# Altium schematic sheet power_supply.SchDoc
size A3
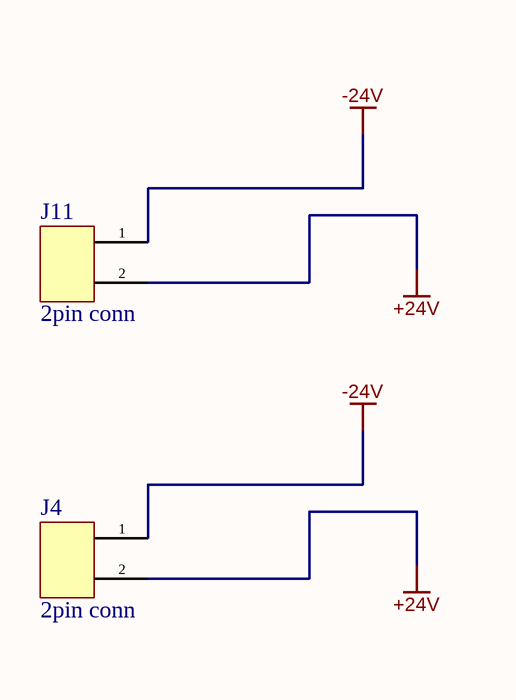
[diagram p0: power_supply.SchDoc]

## Parts
J4  2pin conn  [2pin_0.1in]
J11  2pin conn  [2pin_0.1in]

## Nets
+24V: J4.2 J11.2
-24V: J4.1 J11.1

## Library data of the parts
J4 J11 = 640456-2: CONN HEADER VERT 2POS 2.54MM; Manufacturer: TE Connectivity; Connector Type: Connector,Pin,Plug,Header; Contact Resistance: 6mR; Max Voltage Rating (AC): 250V; Number of Positions: 2; Backwall/Post Interruptions: No (Without); Connector System: Wire-to-Board; Plating Thickness: 3.81um; PCB Mount Retention: Without; Contact Current Rating: 5A; Gender: Male; PCB Mounting Orientation: Vertical; Circuit Application: Signal; Contact Style: Straight; Mating Connector Lock: Yes (With); Contact Post Length: 3.56mm; PCB Thickness: 0.063inch; Tail Length: 0.14inch; Approvals: CSA; Supplier 1: Digi-Key; Manufacturer Part Number: 640456-2; Stock 1: 105696; Pricing 1: 1=0.11, 10=0.107, 100=0.0663, 500=0.05486, 1000=0.048, 5000=0.04114, 10000=0.04 (USD); Mount: Through Hole; Color: Natural,White,Beige; Contact Plating: Tin; Contact Material: Copper Alloy; Housing Color: Natural; Housing Material: Polyester; Contact Shape: Square; Min Operating Temperature: -67°C; Max Operating Temperature: 221°C; Package Quantity: 5000; Packaging: Bulk; Termination: Solder; Number of Rows: 1; Fastening Type: Friction; Contact Gender: Male; Voltage Rating (AC): 250V; Number of Contacts: 2; Orientation: Straight; Contact Retention: No (Without); Mating Alignment: No (Without); Mating Retention: No (Without); PCB Mount Alignment: No (Without); Sealable: No (Without); Strain Relief: No (Without); Shrouded: No (Without); Current Rating: 5A; Number of Poles: 2; Voltage Rating: 250V; Working Voltage: 250V; Panel Mount Retention: No (Without); Mounting Ears: No (Without); Length: 7.62mm; Height: 7.87mm; Pitch: 2.54mm; Depth: 5.72mm; Lead Pitch: 2.54mm; Contact Mating Length: 7.49mm; Radiation Hardening: No; ELV: Compliant; Lead Free: Lead Free; Flammability Rating: UL94 V-0; REACH SVHC: No SVHC; ComponentLink1URL: https://www.te.com/commerce/DocumentDelivery/DDEController?Action=srchrtrv&DocNm=640456&DocType=Customer+Drawing&DocLang=English&src-supplier=Digi-Key; ComponentLink1Description: https://www.te.com/commerce/DocumentDelivery/DDEController?Action=srchrtrv&DocNm=640456&DocType=Customer+Drawing&DocLang=English&src-supplier=Digi-Key; ComponentLink2URL: http://www.te.com/commerce/DocumentDelivery/DDEController?Action=showdoc&DocId=Data+Sheet%7F82056_MTA%7F0608%7Fpdf%7FEnglish%7FENG_DS_82056_MTA_0608.pdf%7F640456-6&src-supplier=Avnet; ComponentLink2Description: http://www.te.com/commerce/DocumentDelivery/DDEController?Action=showdoc&DocId=Data+Sheet%7F82056_MTA%7F0608%7Fpdf%7FEnglish%7FENG_DS_82056_MTA_0608.pdf%7F640456-6&src-supplier=Avnet; ComponentLink3URL: https://www.distrelec.biz/Web/Downloads/43/01/04384301.pdf?mime=application%2Fpdf&src-supplier=Distrelec; ComponentLink3Description: https://www.distrelec.biz/Web/Downloads/43/01/04384301.pdf?mime=application%2Fpdf&src-supplier=Distrelec; ComponentLink4URL: http://www.farnell.com/datasheets/2043229.pdf?src-supplier=Newark; ComponentLink4Description: http://www.farnell.com/datasheets/2043229.pdf?src-supplier=Newark; ComponentLink5URL: http://www.te.com/commerce/DocumentDelivery/DDEController?Action=showdoc&DocId=Data+Sheet%7F82056_MTA%7F0608%7Fpdf%7FEnglish%7FENG_DS_82056_MTA_0608.pdf%7F640456-2&src-supplier=Future+Electronics; ComponentLink5Description: http://www.te.com/commerce/DocumentDelivery/DDEController?Action=showdoc&DocId=Data+Sheet%7F82056_MTA%7F0608%7Fpdf%7FEnglish%7FENG_DS_82056_MTA_0608.pdf%7F640456-2&src-supplier=Future+Electronics; ComponentLink6URL: http://www.te.com/commerce/DocumentDelivery/DDEController?Action=showdoc&DocId=Data+Sheet%7F82056_MTA%7F0608%7Fpdf%7FEnglish%7FENG_DS_82056_MTA_0608.pdf%7F640456-6&src-supplier=Avnet+Asia; ComponentLink6Description: http://www.te.com/commerce/DocumentDelivery/DDEController?Action=showdoc&DocId=Data+Sheet%7F82056_MTA%7F0608%7Fpdf%7FEnglish%7FENG_DS_82056_MTA_0608.pdf%7F640456-6&src-supplier=Avnet+Asia; Supplier Part Number 1: A1921-ND